# Altium schematic sheet ushio_rp2040.SchDoc: USHIO RP2040
size A3; SheetNumber: 1; SheetTotal: 1
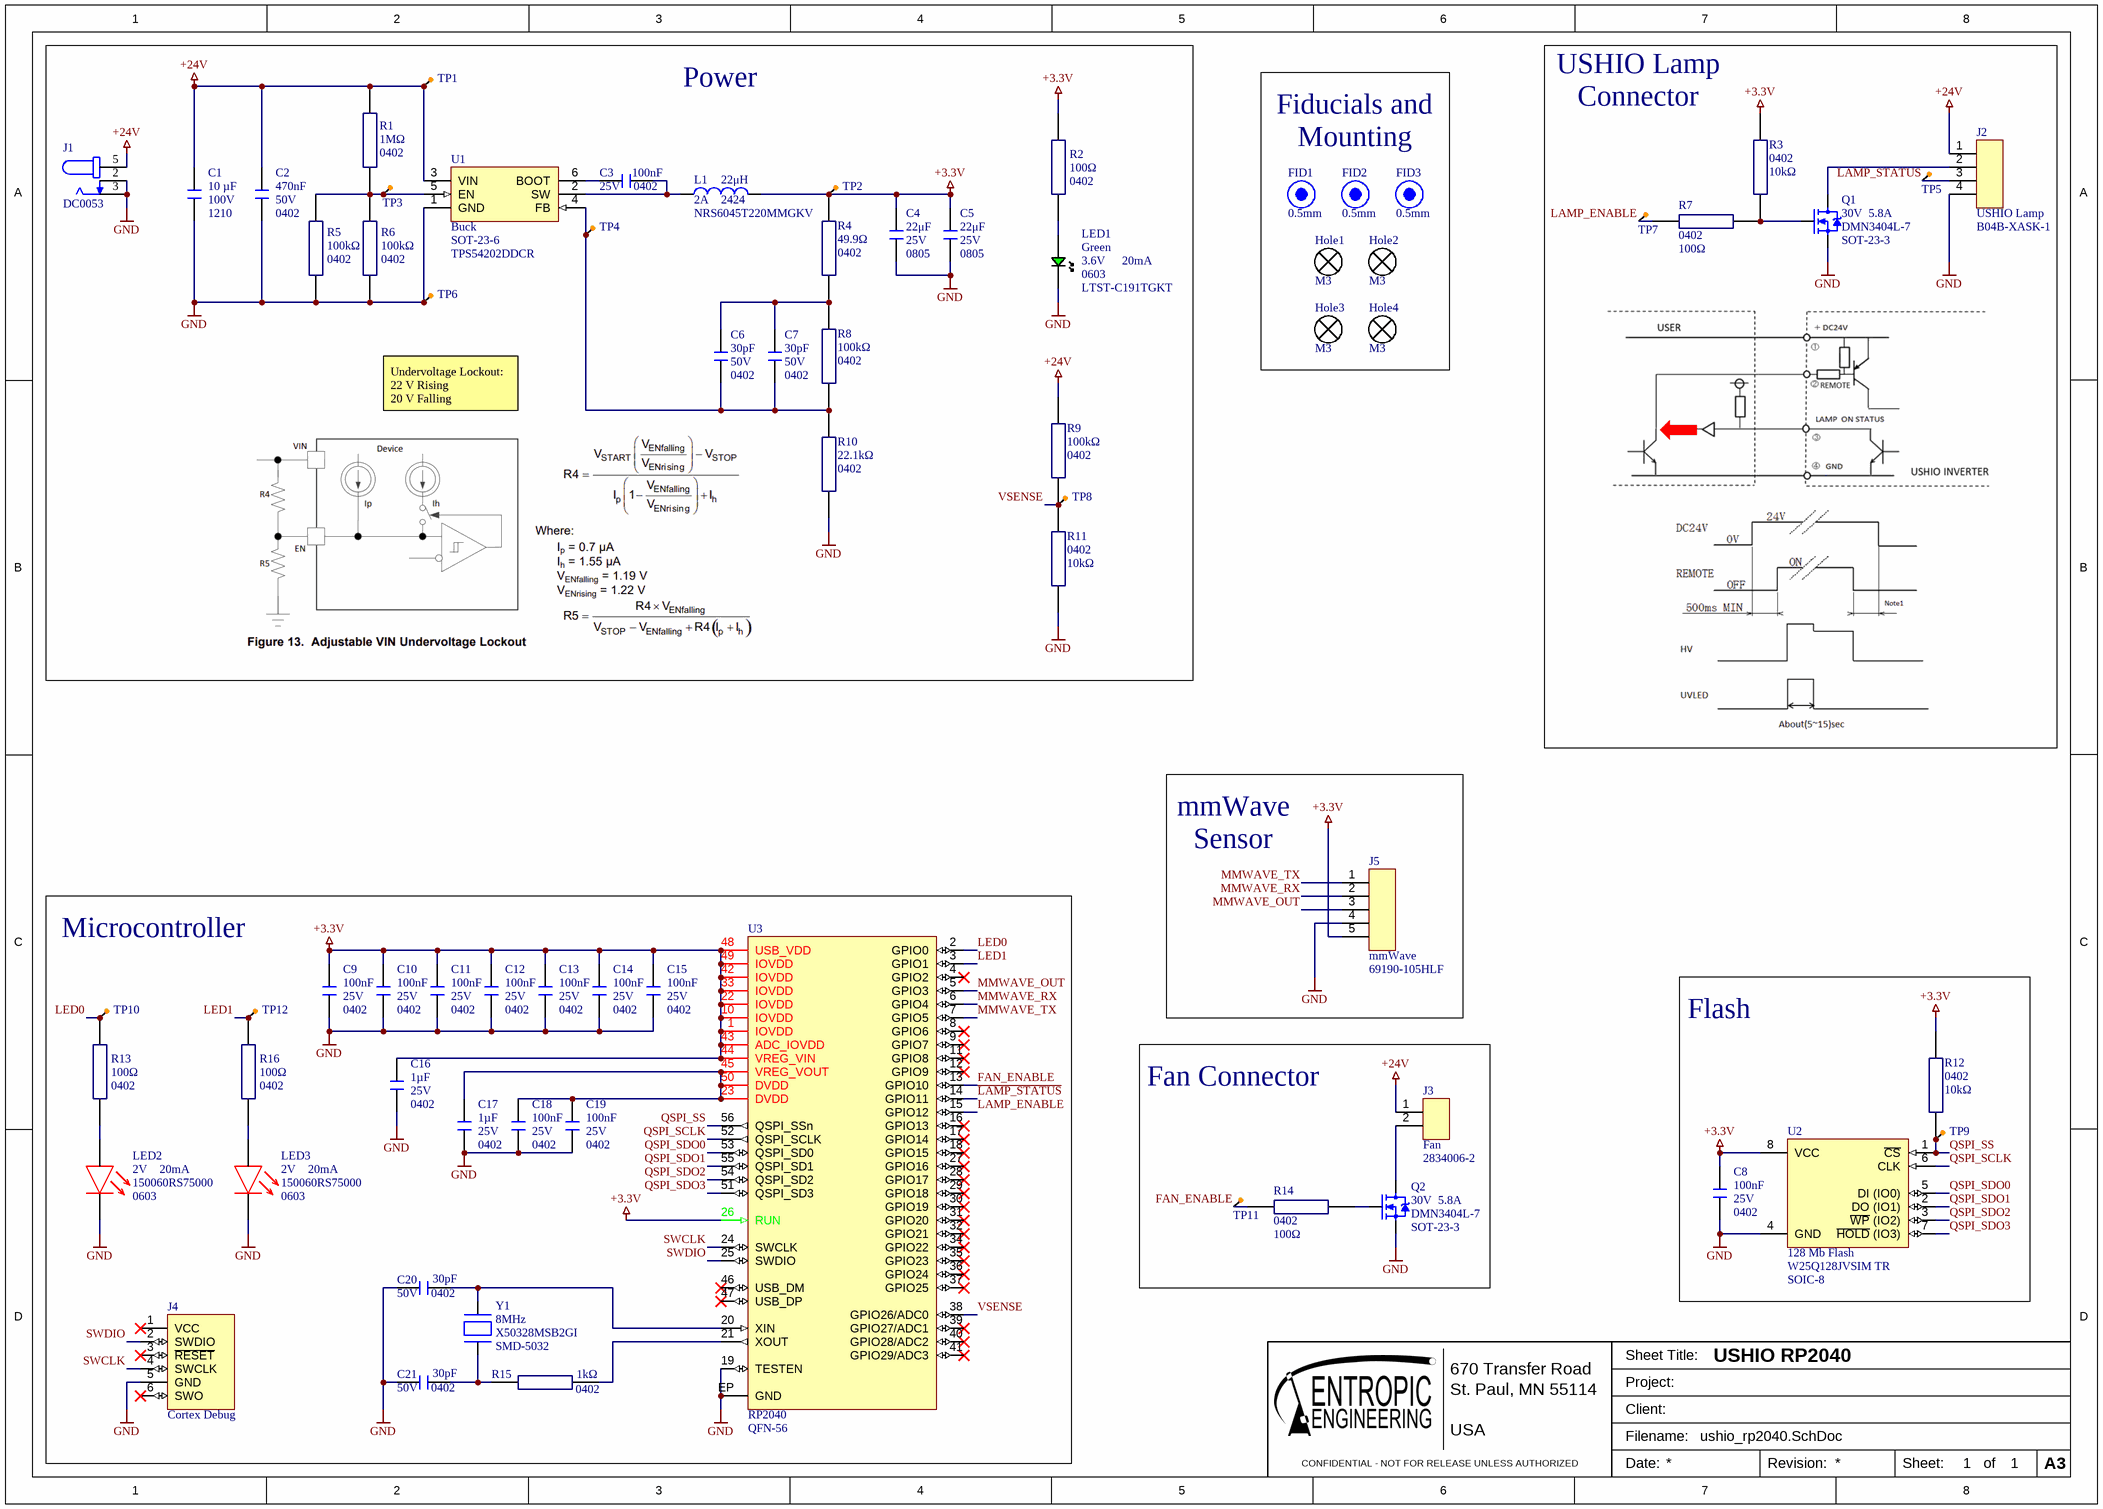
[diagram p0: ushio_rp2040.SchDoc]

## Parts
C1  Voltage Rating: 100V  Case/Package: 1210  Capacitance: 10 µF  [1210_capacitor]  (hidden comment: GRM32EC72A106KE05L)
C2  Package: 0402  Voltage Rating (DC): 50V  Capacitance: 470nF  [0402_capacitor]  (hidden comment: GRM155R61H474KE11D)
C3  Case Code (Imperial): 0402  Voltage: 25V  Capacitance: 100nF  [0402_capacitor]  (hidden comment: GRM155R71E104KE14D)
C4  value 22μF  Rated DC Voltage (URdc): 25V  Case/Package: 0805  [0805_capacitor]  (hidden comment: GRT21BR61E226ME13L)
C5  value 22μF  Rated DC Voltage (URdc): 25V  Case/Package: 0805  [0805_capacitor]  (hidden comment: GRT21BR61E226ME13L)
C6  value 30pF  Rated DC Voltage (URdc): 50V  Case/Package: 0402  [0402_capacitor]  (hidden comment: GCM1555C1H300FA16D)
C7  value 30pF  Rated DC Voltage (URdc): 50V  Case/Package: 0402  [0402_capacitor]  (hidden comment: GCM1555C1H300FA16D)
C8  Case Code (Imperial): 0402  Voltage: 25V  Capacitance: 100nF  [0402_capacitor]  (hidden comment: GRM155R71E104KE14D)
C9  Case Code (Imperial): 0402  Voltage: 25V  Capacitance: 100nF  [0402_capacitor]  (hidden comment: GRM155R71E104KE14D)
C10  Case Code (Imperial): 0402  Voltage: 25V  Capacitance: 100nF  [0402_capacitor]  (hidden comment: GRM155R71E104KE14D)
C11  Case Code (Imperial): 0402  Voltage: 25V  Capacitance: 100nF  [0402_capacitor]  (hidden comment: GRM155R71E104KE14D)
C12  Case Code (Imperial): 0402  Voltage: 25V  Capacitance: 100nF  [0402_capacitor]  (hidden comment: GRM155R71E104KE14D)
C13  Case Code (Imperial): 0402  Voltage: 25V  Capacitance: 100nF  [0402_capacitor]  (hidden comment: GRM155R71E104KE14D)
C14  Case Code (Imperial): 0402  Voltage: 25V  Capacitance: 100nF  [0402_capacitor]  (hidden comment: GRM155R71E104KE14D)
C15  Case Code (Imperial): 0402  Voltage: 25V  Capacitance: 100nF  [0402_capacitor]  (hidden comment: GRM155R71E104KE14D)
C16  Size Code: 0402  Capacitance: 1µF  Voltage: 25V  [0402_capacitor]  (hidden comment: GRM155R61E105KA12D)
C17  Size Code: 0402  Capacitance: 1µF  Voltage: 25V  [0402_capacitor]  (hidden comment: GRM155R61E105KA12D)
C18  Case Code (Imperial): 0402  Voltage: 25V  Capacitance: 100nF  [0402_capacitor]  (hidden comment: GRM155R71E104KE14D)
C19  Case Code (Imperial): 0402  Voltage: 25V  Capacitance: 100nF  [0402_capacitor]  (hidden comment: GRM155R71E104KE14D)
C20  value 30pF  Rated DC Voltage (URdc): 50V  Case/Package: 0402  [0402_capacitor]  (hidden comment: GCM1555C1H300FA16D)
C21  value 30pF  Rated DC Voltage (URdc): 50V  Case/Package: 0402  [0402_capacitor]  (hidden comment: GCM1555C1H300FA16D)
FID1  Package: 0.5mm  [fiducial-0.5]  (hidden comment: FID?)  (no BOM)
FID2  Package: 0.5mm  [fiducial-0.5]  (hidden comment: FID?)  (no BOM)
FID3  Package: 0.5mm  [fiducial-0.5]  (hidden comment: FID?)  (no BOM)
Hole1  M3  [m3_hole_no_pad]  (no BOM)
Hole2  M3  [m3_hole_no_pad]  (no BOM)
Hole3  M3  [m3_hole_no_pad]  (no BOM)
Hole4  M3  [m3_hole_no_pad]  (no BOM)
J1  DC0053  [DC0053]
J2  USHIO Lamp  [B04B-XASK-1]
J3  Fan  [2834006-2]
J4  Cortex Debug  [debug_header]  (no BOM)
J5  mmWave  [69190-105HLF]
L1  Case/Size Code: 2424  Max Current Rating: 2A  Inductance-Nom (L): 22μH  [2424_inductor]  (hidden comment: NRS6045T220MMGKV)
LED1  Forward Current-Max: 20mA  Forward Voltage-Max: 3.6V  Color: Green  Package: 0603  [0603_diode]  (hidden comment: LTST-C191TGKT)
LED2  Forward Current: 20mA  Forward Voltage: 2V  package: 0603  [0603_diode]  (hidden comment: 150060RS75000)
LED3  Forward Current: 20mA  Forward Voltage: 2V  package: 0603  [0603_diode]  (hidden comment: 150060RS75000)
Q1  DS Breakdown Voltage-Min: 30V  Drain Current-Max (ID): 5.8A  [SOT-23-3]  (hidden comment: DMN3404L-7)
Q2  DS Breakdown Voltage-Min: 30V  Drain Current-Max (ID): 5.8A  [SOT-23-3]  (hidden comment: DMN3404L-7)
R1  Size Code: 0402  Resistance: 1MΩ  [0402_resistor]  (hidden comment: RC0402FR-071ML)
R2  Case Code (Imperial): 0402  Resistance: 100Ω  [0402_resistor]  (hidden comment: RMCF0402FT100R)
R3  Case Code (Imperial): 0402  Resistance: 10kΩ  [0402_resistor]  (hidden comment: RMCF0402FT10K0)
R4  Resistance: 49.9Ω  Case Code (Imperial): 0402  [0402_resistor]  (hidden comment: RMCF0402FT49R9)
R5  value 100kΩ  Case/Package: 0402  [0402_resistor]  (hidden comment: RMCF0402FT100K)
R6  value 100kΩ  Case/Package: 0402  [0402_resistor]  (hidden comment: RMCF0402FT100K)
R7  Case Code (Imperial): 0402  Resistance: 100Ω  [0402_resistor]  (hidden comment: RMCF0402FT100R)
R8  value 100kΩ  Case/Package: 0402  [0402_resistor]  (hidden comment: RMCF0402FT100K)
R9  value 100kΩ  Case/Package: 0402  [0402_resistor]  (hidden comment: RMCF0402FT100K)
R10  value 22.1kΩ  Case/Package: 0402  [0402_resistor]  (hidden comment: RMCF0402FT22K1)
R11  Case Code (Imperial): 0402  Resistance: 10kΩ  [0402_resistor]  (hidden comment: RMCF0402FT10K0)
R12  Case Code (Imperial): 0402  Resistance: 10kΩ  [0402_resistor]  (hidden comment: RMCF0402FT10K0)
R13  Case Code (Imperial): 0402  Resistance: 100Ω  [0402_resistor]  (hidden comment: RMCF0402FT100R)
R14  Case Code (Imperial): 0402  Resistance: 100Ω  [0402_resistor]  (hidden comment: RMCF0402FT100R)
R15  Size Code: 0402  Resistance: 1kΩ  [0402_resistor]  (hidden comment: CR0402-FX-1001GLF)
R16  Case Code (Imperial): 0402  Resistance: 100Ω  [0402_resistor]  (hidden comment: RMCF0402FT100R)
TP1  test_point-1  [test_point-1]  (value not drawn)  (no BOM)
TP2  test_point-1  [test_point-1]  (value not drawn)  (no BOM)
TP3  test_point-1  [test_point-1]  (value not drawn)  (no BOM)
TP4  test_point-1  [test_point-1]  (value not drawn)  (no BOM)
TP5  test_point-1  [test_point-1]  (value not drawn)  (no BOM)
TP6  test_point-1  [test_point-1]  (value not drawn)  (no BOM)
TP7  test_point-1  [test_point-1]  (value not drawn)  (no BOM)
TP8  test_point-1  [test_point-1]  (value not drawn)  (no BOM)
TP9  test_point-1  [test_point-1]  (value not drawn)  (no BOM)
TP10  test_point-1  [test_point-1]  (value not drawn)  (no BOM)
TP11  test_point-1  [test_point-1]  (value not drawn)  (no BOM)
TP12  test_point-1  [test_point-1]  (value not drawn)  (no BOM)
U1  Buck  [SOT-23-6]
U2  128 Mb Flash  Case/Package: SOIC-8  [SOIC-8_wide]
U3  RP2040  [QFN-56]
Y1  Frequency: 8MHz  [SMD-5032]  (hidden comment: X50328MSB2GI)

## Nets
+3.3V: C4.2 C5.2 C8.2 C9.2 C10.2 C11.2 C12.2 C13.2 C14.2 C15.2 C16.2 J5.5 L1.2 R2.2 R3.1 R4.2 R12.2 TP2.1 U2.8(VCC) U3.1(IOVDD) U3.10(IOVDD) U3.22(IOVDD) U3.26(RUN) U3.33(IOVDD) U3.42(IOVDD) U3.43(ADC_IOVDD) U3.44(VREG_VIN) U3.48(USB_VDD) U3.49(IOVDD)
+24V: C1.2 C2.2 J1.5(TIP) J2.1 J3.1 R1.2 R9.2 TP1.1 U1.3(VIN)
GND: C1.1 C2.1 C4.1 C5.1 C8.1 C9.1 C10.1 C11.1 C12.1 C13.1 C14.1 C15.1 C16.1 C17.1 C18.1 C19.1 C20.1 C21.1 J1.2(SWITCH) J1.3(SLEEVE) J2.4 J4.5(GND) J5.4 LED1.2(K) LED2.2 LED3.2 Q1.2(S) Q2.2(S) R5.1 R6.1 R10.1 R11.1 TP6.1 U1.1(GND) U2.4(GND) U3.19(TESTEN) U3.EP(GND)
~{LAMP_STATUS}: J2.3 TP5.1 U3.14(GPIO11)
FAN_ENABLE: R14.1 TP11.1 U3.13(GPIO10)
LAMP_ENABLE: R7.1 TP7.1 U3.15(GPIO12)
LED0: R13.2 TP10.1 U3.2(GPIO0)
LED1: R16.2 TP12.1 U3.3(GPIO1)
MMWAVE_OUT: J5.3 U3.5(GPIO3)
MMWAVE_RX: J5.2 U3.6(GPIO4)
MMWAVE_TX: J5.1 U3.7(GPIO5)
QSPI_SCLK: U2.6(CLK) U3.52(QSPI_SCLK)
QSPI_SDO0: U2.5(DI_(IO0)) U3.53(QSPI_SD0)
QSPI_SDO1: U2.2(DO_(IO1)) U3.55(QSPI_SD1)
QSPI_SDO2: U2.3(~{WP}_(IO2)) U3.54(QSPI_SD2)
QSPI_SDO3: U2.7(~{HOLD}_(IO3)) U3.51(QSPI_SD3)
QSPI_SS: R12.1 TP9.1 U2.1(~{CS}) U3.56(QSPI_SSn)
SWCLK: J4.4(SWCLK) U3.24(SWCLK)
SWDIO: J4.2(SWDIO) U3.25(SWDIO)
VSENSE: R9.1 R11.2 TP8.1 U3.38(GPIO26/ADC0)
NetC3_1: C3.1 L1.1 U1.2(SW)
NetC3_2: C3.2 U1.6(BOOT)
NetC6_1: C6.1 C7.1 R8.1 R10.2 TP4.1 U1.4(FB)
NetC6_2: C6.2 C7.2 R4.1 R8.2
NetC17_2: C17.2 C18.2 C19.2 U3.23(DVDD) U3.45(VREG_VOUT) U3.50(DVDD)
NetC20_2: C20.2 U3.20(XIN) Y1.2
NetC21_2: C21.2 R15.1 Y1.1
NetJ2_2: J2.2 Q1.3(D)
NetJ3_2: J3.2 Q2.3(D)
NetLED1_1: LED1.1(A) R2.1
NetLED2_1: LED2.1 R13.1
NetLED3_1: LED3.1 R16.1
NetQ1_1: Q1.1(G) R3.2 R7.2
NetQ2_1: Q2.1(G) R14.2
NetR1_1: R1.1 R5.2 R6.2 TP3.1 U1.5(EN)
NetR15_2: R15.2 U3.21(XOUT)

Not connected (* = marked no-connect by the designer): J4 1(VCC)* 3(~{RESET})* 6(SWO)*; U3 4(GPIO2)* 8(GPIO6)* 9(GPIO7)* 11(GPIO8)* 12(GPIO9)* 16(GPIO13)* 17(GPIO14)* 18(GPIO15)* 27(GPIO16)* 28(GPIO17)* 29(GPIO18)* 30(GPIO19)* 31(GPIO20)* 32(GPIO21)* 34(GPIO22)* 35(GPIO23)* 36(GPIO24)* 37(GPIO25)* 39(GPIO27/ADC1)* 40(GPIO28/ADC2)* 41(GPIO29/ADC3)* 46(USB_DM)* 47(USB_DP)*

## Notes on the sheet
- Power
- Fiducials and Mounting
- (near R3) USHIO Lamp Connector
- Undervoltage Lockout:
  22 V Rising
  20 V Falling
- mmWave Sensor
- Microcontroller
- Flash
- Fan Connector
- 670 Transfer Road
- St. Paul, MN 55114
- Sheet Title:
- Project:
- CONFIDENTIAL - NOT FOR RELEASE UNLESS AUTHORIZED
- USA
- Client:
- Filename:
- Date:
- Revision:
- Sheet:
- of
- A3

## Library data of the parts
C1 = GRM32EC72A106KE05L: 10 µF, 100 V, 1210 Ceramic capacitor; Manufacturer: Murata; Tolerance: 10%; Supplier 1: Digi-Key; Stock 1: 4827; Pricing 1: 1=1.38, 10=1.087, 100=0.8151, 500=0.61582 (USD); Mount: Surface Mount; Case Code (Imperial): 1210; Case Code (Metric): 3225; Min Operating Temperature: -55°C; Max Operating Temperature: 125°C; Packaging: Tape and Reel; ComponentLink1URL: http://search.murata.co.jp/Ceramy/image/img/A01X/G101/ENG/GRM32EC72A106KE05-01.pdf?src-supplier=Digi-Key; ComponentLink1Description: http://search.murata.co.jp/Ceramy/image/img/A01X/G101/ENG/GRM32EC72A106KE05-01.pdf?src-supplier=Digi-Key; Supplier Part Number 1: 490-16266-1-ND; Manufacturer Part Number: GRM32EC72A106KE05L
C2 = GRM155R61H474KE11D: 470 nF, 50 V, X5R, 0402 Chip capacitor; Manufacturer: Murata; house_part_number: C-470nF-0402-002; Tolerance: 10%; Supplier 1: Digi-Key; Supplier Part Number 1: 490-16354-1-ND; RoHS: Yes; Category: Ceramic Capacitors; Pricing 1: 1=0.20000, 10=0.14600, 50=0.08260, 100=0.06840, 500=0.04798, 1000=0.03972, 2500=0.03696, 5000=0.03382 (USD); Dielectric: X5R; Length: 1mm; Width: 500um; Thickness: 500um; RoHS Compliant: Yes; ComponentLink1URL: http://search.murata.co.jp/Ceramy/image/img/A01X/G101/ENG/GRM155R61H474KE11-01.pdf?src-supplier=Digi-Key; ComponentLink1Description: http://search.murata.co.jp/Ceramy/image/img/A01X/G101/ENG/GRM155R61H474KE11-01.pdf?src-supplier=Digi-Key; ComponentLink2URL: https://search.murata.co.jp/Ceramy/image/img/A01X/G101/ENG/GRM155R61H474KE11-01.pdf?src-supplier=Digi-Key; ComponentLink2Description: https://search.murata.co.jp/Ceramy/image/img/A01X/G101/ENG/GRM155R61H474KE11-01.pdf?src-supplier=Digi-Key; Manufacturer Part Number: GRM155R61H474KE11D
C3 C8-C15 C18 C19 = GRM155R71E104KE14D: 100 nF, 25 V, X7R, 0402 Chip capacitor; Manufacturer: Murata; house_part_number: C-100nF-0402-002; Dielectric Material: Ceramic; Tolerance: 10%; Supplier 1: Digi-Key; Supplier Part Number 1: 490-10698-1-ND; RoHS: Yes; Category: Ceramic Capacitors; Pricing 1: 1=0.10000, 10=0.02700, 50=0.01460, 100=0.01190, 500=0.00848, 1000=0.00666, 2500=0.00605, 5000=0.00557 (USD); Mount: Surface Mount; Case/Package: 0402; Case Code (Metric): 1005; Weight: 0.000212oz; Min Operating Temperature: -55°C; Max Operating Temperature: 125°C; Packaging: Tape and Reel; Voltage Rating: 25V; Dielectric: X7R; Termination: SMD/SMT; Resistor Type: Ceramic; Voltage Rating (DC): 25V; Package Quantity: 10000; Length: 1mm; Width: 0.02inch; Height: 0.5mm; Thickness: 0.022inch; Depth: 0.5mm; REACH SVHC: Unknown; Lead Free: Lead Free; RoHS Compliant: Yes; ComponentLink1URL: http://www.farnell.com/datasheets/1872206.pdf?src-supplier=Farnell; ComponentLink1Description: http://www.farnell.com/datasheets/1872206.pdf?src-supplier=Farnell; ComponentLink2URL: http://components.arrow.com/part/dataview/0323_06361249?src-supplier=Arrow+Europe; ComponentLink2Description: http://components.arrow.com/part/dataview/0323_06361249?src-supplier=Arrow+Europe; ComponentLink3URL: http://uk.rs-online.com/webdocs/144c/0900766b8144c113.pdf?src-supplier=RSComponents; ComponentLink3Description: http://uk.rs-online.com/webdocs/144c/0900766b8144c113.pdf?src-supplier=RSComponents; ComponentLink4URL: http://www.farnell.com/datasheets/2048008.pdf?src-supplier=Farnell; ComponentLink4Description: http://www.farnell.com/datasheets/2048008.pdf?src-supplier=Farnell; ComponentLink5URL: http://www.mouser.com/ds/2/281/c02e-2905.pdf?src-supplier=Mouser; ComponentLink5Description: http://www.mouser.com/ds/2/281/c02e-2905.pdf?src-supplier=Mouser; ComponentLink6URL: http://www.farnell.com/datasheets/2048008.pdf?src-supplier=Newark; ComponentLink6Description: http://www.farnell.com/datasheets/2048008.pdf?src-supplier=Newark; ComponentLink7URL: https://search.murata.co.jp/Ceramy/image/img/A01X/G101/ENG/GRM155R71E104KE14-01.pdf?src-supplier=Digi-Key; ComponentLink7Description: https://search.murata.co.jp/Ceramy/image/img/A01X/G101/ENG/GRM155R71E104KE14-01.pdf?src-supplier=Digi-Key; ComponentLink8URL: http://www.farnell.com/datasheets/2048008.pdf?src-supplier=Element14; ComponentLink8Description: http://www.farnell.com/datasheets/2048008.pdf?src-supplier=Element14; ComponentLink9URL: http://psearch.en.murata.com/capacitor/product/GRM155R71E104KE14%23.pdf?src-supplier=Avnet; ComponentLink9Description: http://psearch.en.murata.com/capacitor/product/GRM155R71E104KE14%23.pdf?src-supplier=Avnet; Manufacturer Part Number: GRM155R71E104KE14D
C4 C5 = GRT21BR61E226ME13L: 22 μF, 25 V, X5R, 0805 Chip capacitor; Manufacturer: Murata; Dielectric Material: Ceramic; Multilayer: Yes; Tolerance  (fill in as +-): 20%; Reference Standard: AEC-Q200; Supplier 1: Digi-Key; RoHS: Yes; Category: Ceramic Capacitors; Stock 1: 1983731; Pricing 1: 1=0.48, 10=0.338, 50=0.2558, 100=0.2228, 500=0.16508, 1000=0.14031 (USD); Mounting Technology: Surface Mount; Pins: 2; Package Shape: Rectangular; Terminal Finish: Nickel; Min Operating Temperature: -55°C; Max Operating Temperature: 85°C; JESD-609 Code: e3; Capacitor Type: Ceramic; Packaging: Tape and Reel; Tolerance (fill in as +-): 20%; Temperature Characteristics Code: X5R; Termination: Wraparound; Reach SVHC Compliant: Yes; RoHS Compliant: Yes; ComponentLink1URL: https://datasheet.ciiva.com:443/pdfs/VipMasterIC/IC/MURE/MURE-S-A0004410517/MURE-S-A0004413512-1.pdf?src-supplier=IHS+Markit; ComponentLink1Description: https://datasheet.ciiva.com:443/pdfs/VipMasterIC/IC/MURE/MURE-S-A0004410517/MURE-S-A0004413512-1.pdf?src-supplier=IHS+Markit; ComponentLink2URL: http://search.murata.co.jp/Ceramy/image/img/A01X/G101/ENG/GRT21BR61E226ME13-01.pdf?src-supplier=Digi-Key; ComponentLink2Description: http://search.murata.co.jp/Ceramy/image/img/A01X/G101/ENG/GRT21BR61E226ME13-01.pdf?src-supplier=Digi-Key; Manufacturer Part Number: GRT21BR61E226ME13L; Supplier Part Number 1: 490-12389-1-ND
C6 C7 C20 C21 = GCM1555C1H300FA16D: 30 pF, 50 V, C0G, 0402 Chip capacitor; Manufacturer: Murata; Dielectric Material: Ceramic; Multilayer: Yes; Tolerance  (fill in as +-): 1%; Reference Standard: AEC-Q200; Supplier 1: LCSC; Manufacturer Part Number: GCM1555C1H300FA16D; RoHS: Yes; Category: Ceramic Capacitors; Stock 1: 20680; Pricing 1: 20=0.0242, 200=0.0198, 600=0.0174, 2000=0.0159, 10000=0.0143, 20000=0.0137 (USD); Mounting Technology: Surface Mount; Pins: 2; Package Shape: Rectangular; Min Operating Temperature: -55°C; Max Operating Temperature: 125°C; Capacitor Type: Ceramic; Packaging: Tape and Reel; Tolerance (fill in as +-): 1%; Temperature Characteristics Code: C0G; Termination: Wraparound; Reach SVHC Compliant: Yes; RoHS Compliant: Yes; ComponentLink1URL: https://psearch.en.murata.com:443/capacitor/product/GCM1555C1H300FA16%23.pdf?src-supplier=IHS+Markit; ComponentLink1Description: https://psearch.en.murata.com:443/capacitor/product/GCM1555C1H300FA16%23.pdf?src-supplier=IHS+Markit; Supplier Part Number 1: C2987943
C16 C17 = GRM155R61E105KA12D: 1 µF, 25 V, X5R, 0402 Chip capacitor; Manufacturer: Murata; house_part_number: C-1uF-0402-002; Dielectric Material: Ceramic; Multilayer: Yes; Negative Tolerance: 10%; Supplier 1: Digi-Key; Supplier Part Number 1: 490-10017-1-ND; RoHS: Yes; Category: Ceramic Capacitors; Stock 1: 145965; Pricing 1: 1=0.11000, 10=0.08300, 50=0.04560, 100=0.03720, 500=0.02656, 1000=0.02087, 2500=0.01898, 5000=0.01746 (USD); Mount: Surface Mount; Number of Pins: 2; Package Shape: Rectangular; Terminal Finish: Nickel; Min Operating Temperature: -55°C; Max Operating Temperature: 85°C; JESD-609 Code: e3; Capacitor Type: Ceramic; Package Style: SMTMeter; Packaging: Tape and Reel; Positive Tolerance: 10%; Temperature Characteristics Code: X5R; Termination: Wraparound; Length: 1mm; Width: 0.5mm; Height: 0.5mm; REACH SVHC: Yes; RoHS Compliant: Yes; ComponentLink1URL: https://datasheet.ciiva.com:443/pdfs/VipMasterIC/IC/MURE/MURE-S-A0004362469/MURE-S-A0004364524-1.pdf?src-supplier=IHS+Markit; ComponentLink1Description: https://datasheet.ciiva.com:443/pdfs/VipMasterIC/IC/MURE/MURE-S-A0004362469/MURE-S-A0004364524-1.pdf?src-supplier=IHS+Markit; ComponentLink2URL: https://datasheet.ciiva.com/7719/1666664-7719006.pdf?src-supplier=Element14; ComponentLink2Description: https://datasheet.ciiva.com/7719/1666664-7719006.pdf?src-supplier=Element14; ComponentLink3URL: https://datasheet.ciiva.com/22732/1666664-22732122.pdf?src-supplier=Element14; ComponentLink3Description: https://datasheet.ciiva.com/22732/1666664-22732122.pdf?src-supplier=Element14; Manufacturer Part Number: GRM155R61E105KA12D
FID1-FID3 = fiducial-0.5: 0.5mm round fiducial
Hole1-Hole4 = m3_hole_no_pad: M3 clearance hole; pickable: no
J1 = DC0053: 5.5 mm x 2 mm Barrel jack; Manufacturer: SHOU HAN; Supplier 1: LCSC; RoHS: No; Category: Uncategorized; Stock 1: 2415; Pricing 1: 5=0.0927, 50=0.0762, 150=0.0679, 500=0.0565, 2500=0.0515, 5000=0.0491 (USD); Supplier Part Number 1: C668601; Manufacturer Part Number: DC0053
J2 = B04B-XASK-1: 4-pin JST XA header, 2.5mm pitch, through-hole; Supplier 1: Digi-Key; Manufacturer: JST; RoHS: No; Category: Connectors; Stock 1: 159148; Pricing 1: 1=0.32, 10=0.269, 100=0.2093, 500=0.17938, 1000=0.14948, 5000=0.12812, 10000=0.11958 (USD); ComponentLink1URL: https://datasheet.ciiva.com/719/exa1-719638.pdf?src-supplier=Digi-Key; ComponentLink1Description: https://datasheet.ciiva.com/719/exa1-719638.pdf?src-supplier=Digi-Key; Supplier Part Number 1: 455-B04B-XASK-1-ND; Manufacturer Part Number: B04B-XASK-1
J3 = 2834006-2: 2-Pin Barrier Strip Terminal Block; Manufacturer: TE Connectivity; Supplier 1: LCSC; RoHS: Yes; Category: Connectors; Stock 1: 6498; Pricing 1: 1=0.4073, 10=0.3326, 30=0.3007, 100=0.261, 500=0.2212, 800=0.21 (USD); Terminal and Terminal Block Type: BARRIER STRIP TERMINAL BLOCK; Reach SVHC Compliant: Yes; RoHS Compliant: Yes; ComponentLink1URL: https://datasheet.ciiva.com:443/pdfs/VipMasterIC/IC/TYEL/TYEL-S-A0008901127/TYEL-S-A0008894062-1.pdf?src-supplier=IHS+Markit; ComponentLink1Description: https://datasheet.ciiva.com:443/pdfs/VipMasterIC/IC/TYEL/TYEL-S-A0008901127/TYEL-S-A0008894062-1.pdf?src-supplier=IHS+Markit; ComponentLink2URL: http://www.mouser.com/ds/2/418/NG_CD_2834006_A-773085.pdf?src-supplier=Mouser; ComponentLink2Description: http://www.mouser.com/ds/2/418/NG_CD_2834006_A-773085.pdf?src-supplier=Mouser; ComponentLink3URL: http://www.farnell.com/datasheets/2299783.pdf?src-supplier=Farnell; ComponentLink3Description: http://www.farnell.com/datasheets/2299783.pdf?src-supplier=Farnell; ComponentLink4URL: http://www.farnell.com/datasheets/2299783.pdf?src-supplier=Element14; ComponentLink4Description: http://www.farnell.com/datasheets/2299783.pdf?src-supplier=Element14; ComponentLink5URL: http://www.farnell.com/datasheets/2017940.pdf?src-supplier=Element14; ComponentLink5Description: http://www.farnell.com/datasheets/2017940.pdf?src-supplier=Element14; ComponentLink6URL: https://www.te.com/commerce/DocumentDelivery/DDEController?Action=srchrtrv&amp;DocNm=2834006&amp;DocType=Customer+Drawing&amp;DocLang=English&src-supplier=Digi-Key; ComponentLink6Description: https://www.te.com/commerce/DocumentDelivery/DDEController?Action=srchrtrv&amp;DocNm=2834006&amp;DocType=Customer+Drawing&amp;DocLang=English&src-supplier=Digi-Key; Supplier Part Number 1: C86483; Manufacturer Part Number: 2834006-2
J4 = debug_header: Tag-connect 6-pin pogo header; pickable: no
J5 = 69190-105HLF: 5-pin 0.1" unshrouded header pins; Manufacturer: Amphenol ICC / FCI; Manufacturer Series: 69190; Connector Type: BOARD CONNECTOR; Option: General Purpose; Contact Pattern: RECTANGULAR; Contact Style: SQ PIN-SKT; Filter Feature: No; Number Of Connectors: 1; Number of Contacts: 5; Body Breadth: 0.095inch; Body Depth: 0.1inch; Body Length: 0.5inch; Mounting Option 1: LOCKING; Plating Thickness: 30uin; Reference Standard: UL; Reliability: COMMERCIAL; Supplier 1: Digi-Key; RoHS: Yes; Category: Connectors; Stock 1: 3670; Pricing 1: 1=0.47, 10=0.402, 100=0.3123, 500=0.26768, 1000=0.22306, 5000=0.19119, 10000=0.17845 (USD); Mounting Technology: Board; Contact Material: Bronze; Contact Finish - Termination: GOLD (30) OVER NICKEL/NICKEL PALLADIUM GOLD (30) OVER NICKEL; Insulation Color: Black; JESD-609 Code: e4; Contact Gender: Male; Mixed Contacts: No; Mounting Style: STRAIGHT; Number Of PCB Rows: 1; Number of Rows Loaded: 1; PCB Contact Pattern: RECTANGULAR; Termination: Solder; Mating Contact Pitch: 0.1inch; Terminal Length: 0.12inch; Terminal Pitch: 2.54mm; Flammability Rating: UL94 V-0; DIN Conformance: No; IEC Conformance: No; MIL Conformance: No; Reach SVHC Compliant: Yes; RoHS Compliant: Yes; ComponentLink1URL: https://datasheet.ciiva.com/721/69190-721296.pdf?src-supplier=Digi-Key; ComponentLink1Description: https://datasheet.ciiva.com/721/69190-721296.pdf?src-supplier=Digi-Key; Supplier Part Number 1: 609-69190-105HLF-ND; Manufacturer Part Number: 69190-105HLF
L1 = NRS6045T220MMGKV: 22 μH, 2 A, 20%, 2424 Inductor; Manufacturer: Taiyo Yuden; DC Resistance (DCR): 139.1mΩ; Inductor Application: RF INDUCTOR; Inductor Type: GENERAL PURPOSE INDUCTOR; Channels: 1; Self Resonant Frequency: 7MHz; Shape/Size Description: RECTANGULAR PACKAGE; Shielding: Unshielded; Test Frequency: 100kHz; Reference Standard: AEC-Q200; Supplier 1: LCSC; RoHS: Yes; Category: Fixed Inductors; Stock 1: 877; Pricing 1: 1=0.2713, 10=0.2238, 30=0.2035, 100=0.1781, 500=0.1668, 1500=0.16 (USD); Pins: 2; Min Operating Temperature: -40°C; Max Operating Temperature: 125°C; Tolerance: 20%; Surface Mount: Yes; Terminal Placement: Dual Ended; Termination: One Surface; Reach SVHC Compliant: Yes; RoHS Compliant: Yes; ComponentLink1URL: https://datasheet.ciiva.com:443/pdfs/VipMasterIC/IC/TAIY/TAIY-S-A0009101225/TAIY-S-A0009101504-1.pdf?src-supplier=IHS+Markit; ComponentLink1Description: https://datasheet.ciiva.com:443/pdfs/VipMasterIC/IC/TAIY/TAIY-S-A0009101225/TAIY-S-A0009101504-1.pdf?src-supplier=IHS+Markit; ComponentLink2URL: https://datasheet.ciiva.com/29697/nrs6045t220mmgkv-ss-29697444.pdf?src-supplier=Digi-Key; ComponentLink2Description: https://datasheet.ciiva.com/29697/nrs6045t220mmgkv-ss-29697444.pdf?src-supplier=Digi-Key; Supplier Part Number 1: C515390; Manufacturer Part Number: NRS6045T220MMGKV
LED1 = LTST-C191TGKT: Green LED, 0603; Manufacturer: Vishay Lite-On; Shape: Rectangular; Lens Style: WATER CLEAR; Luminous Intensity-Min: 130cd; Luminous Intensity-Nom: 260.5mcd; Number of Functions: 1; Optoelectronic Device Type: SINGLE COLOR LED; Reverse Voltage-Max: 5V; Viewing Angle: 130°; Overall Height: 0.55mm; Supplier 1: Digi-Key; RoHS: Yes; Category: LEDs; Stock 1: 478546; Pricing 1: 1=0.53000, 10=0.32300, 100=0.18580, 1000=0.14544, 2000=0.13332 (USD); Mount: Surface Mount; Number of Pins: 2; Color@wavelength: Green; Terminal Finish: Tin; Min Operating Temperature: -20°C; Max Operating Temperature: 80°C; JESD-609 Code: e3; Packaging: Tape and Reel; Size: 1.1mm; Terminal Pitch: 1.5mm; Reach SVHC Compliant: Yes; RoHS Compliant: Yes; ComponentLink1URL: https://datasheet.ciiva.com:443/pdfs/VipMasterIC/IC/LITE/LITE-S-A0003155974/LITE-S-A0003155974-1.pdf?src-supplier=IHS+Markit; ComponentLink1Description: https://datasheet.ciiva.com:443/pdfs/VipMasterIC/IC/LITE/LITE-S-A0003155974/LITE-S-A0003155974-1.pdf?src-supplier=IHS+Markit; ComponentLink2URL: https://datasheet.ciiva.com/16444/ltst-c191tgkt-16444757.pdf?src-supplier=Future+Electronics; ComponentLink2Description: https://datasheet.ciiva.com/16444/ltst-c191tgkt-16444757.pdf?src-supplier=Future+Electronics; ComponentLink3URL: https://datasheet.ciiva.com/11773/0900766b80dc02b5-11773683.pdf?src-supplier=RSComponents; ComponentLink3Description: https://datasheet.ciiva.com/11773/0900766b80dc02b5-11773683.pdf?src-supplier=RSComponents; ComponentLink4URL: https://datasheet.ciiva.com/12403/lite-on-ltst-c191tgkt-190137-12403796.pdf?src-supplier=Mouser; ComponentLink4Description: https://datasheet.ciiva.com/12403/lite-on-ltst-c191tgkt-190137-12403796.pdf?src-supplier=Mouser; ComponentLink5URL: https://datasheet.ciiva.com/6352/s-110-ltst-c191tgkt-6352682.pdf?src-supplier=Digi-Key; ComponentLink5Description: https://datasheet.ciiva.com/6352/s-110-ltst-c191tgkt-6352682.pdf?src-supplier=Digi-Key; ComponentLink6URL: https://datasheet.ciiva.com/6352/s-110-ltst-c191tgkt-6352684.pdf?src-supplier=Digi-Key; ComponentLink6Description: https://datasheet.ciiva.com/6352/s-110-ltst-c191tgkt-6352684.pdf?src-supplier=Digi-Key; ComponentLink7URL: https://datasheet.ciiva.com/6352/s-110-ltst-c191tgkt-6352683.pdf?src-supplier=Digi-Key; ComponentLink7Description: https://datasheet.ciiva.com/6352/s-110-ltst-c191tgkt-6352683.pdf?src-supplier=Digi-Key; Supplier Part Number 1: 160-1888-1-ND; House Part Number: LTST-C191TGKT; Manufacturer Part Number: LTST-C191TGKT
LED2 LED3 = 150060RS75000: Red 0603 LED; Manufacturer: Wurth Electronics; house_part_number: LED-red-0603-002; Shape: Rectangular; Lens Style: WATER CLEAR; Luminous Intensity-Nom: 250mcd; Number of Functions: 1; Optoelectronic Device Type: SINGLE COLOR LED; Viewing Angle: 140°; Overall Height: 0.7mm; Supplier 1: Digi-Key; Supplier Part Number 1: 732-4978-1-ND; RoHS: Yes; Category: LEDs; Stock 1: 210449; Pricing 1: 1=0.14000, 50=0.13300, 100=0.12000, 500=0.11400, 1000=0.09900 (USD); Mount: Surface Mount; Number of Pins: 2; Color: Red; Min Operating Temperature: -40°C; Max Operating Temperature: 85°C; Packaging: Tape and Reel; Size: 1.1mm; Terminal Pitch: 1.6mm; REACH SVHC: Yes; RoHS Compliant: Yes; ComponentLink1URL: https://datasheet.ciiva.com:443/pdfs/VipMasterIC/IC/MIDC/MIDC-S-A0007768849/MIDC-S-A0007768849-1.pdf?src-supplier=IHS+Markit; ComponentLink1Description: https://datasheet.ciiva.com:443/pdfs/VipMasterIC/IC/MIDC/MIDC-S-A0007768849/MIDC-S-A0007768849-1.pdf?src-supplier=IHS+Markit; ComponentLink2URL: https://datasheet.ciiva.com/29563/150060rs75000-29563040.pdf?src-supplier=Digi-Key; ComponentLink2Description: https://datasheet.ciiva.com/29563/150060rs75000-29563040.pdf?src-supplier=Digi-Key; ComponentLink3URL: https://datasheet.ciiva.com/29279/759428-da-01-en-chipled-0603-w-kl-rot-150060rs75000-29279196.pdf?src-supplier=Conrad; ComponentLink3Description: https://datasheet.ciiva.com/29279/759428-da-01-en-chipled-0603-w-kl-rot-150060rs75000-29279196.pdf?src-supplier=Conrad; Manufacturer Part Number: 150060RS75000
Q1 Q2 = DMN3404L-7: N-FET, 30 V, 5.8 A, SOT-23-3; Manufacturer: Diodes; Package Body Material: Plastic; Transistor Element Material: SILICON; Polarity/Channel Type: N-CHANNEL; Additional Feature: HIGH RELIABILITY; Drain-source On Resistance-Max: 28mR; FET Technology: METAL-OXIDE SEMICONDUCTOR; Number of Elements: 1; Operating Mode: ENHANCEMENT MODE; Power Dissipation-Max (Abs): 1.4W; Pulsed Drain Current-Max (IDM): 30A; Time @ Peak Reflow Temperature-Max (s): 40s; Transistor Application: SWITCHING; Qualification Status: Not Qualified; Supplier 1: Digi-Key; RoHS: Yes; Category: MOSFETs; Stock 1: 150000; Pricing 1: 3000=0.07535, 6000=0.06781, 15000=0.06028, 30000=0.05651, 75000=0.05011, 150000=0.04822 (USD); Pins: 3; Package Shape: Rectangular; Terminal Finish: Tin; Max Operating Temperature: 150°C; JESD-609 Code: e3; Drain Current-Max (Abs) (ID): 5.8A; JESD-30 Code: R-PDSO-G3; Moisture Sensitivity Level: 1; Package Style: SMALL OUTLINEMeter; Peak Reflow Temperature (Cel): 260°C; Surface Mount: Yes; Terminal Form: Gull Wing; Terminal Position: DUAL; Reach SVHC Compliant: Yes; RoHS Compliant: Yes; ComponentLink1URL: https://datasheet.ciiva.com:443/pdfs/VipMasterIC/IC/DIOD/DIODS20277/DIODS20277-1.pdf?src-supplier=IHS+Markit; ComponentLink1Description: https://datasheet.ciiva.com:443/pdfs/VipMasterIC/IC/DIOD/DIODS20277/DIODS20277-1.pdf?src-supplier=IHS+Markit; ComponentLink2URL: https://datasheet.ciiva.com/4444/ds31787-65102-4444489.pdf?src-supplier=Mouser; ComponentLink2Description: https://datasheet.ciiva.com/4444/ds31787-65102-4444489.pdf?src-supplier=Mouser; ComponentLink3URL: https://datasheet.ciiva.com/8115/ds31787-8115384.pdf?src-supplier=Avnet; ComponentLink3Description: https://datasheet.ciiva.com/8115/ds31787-8115384.pdf?src-supplier=Avnet; ComponentLink4URL: https://datasheet.ciiva.com/16508/ds31787-16508477.pdf?src-supplier=Future+Electronics; ComponentLink4Description: https://datasheet.ciiva.com/16508/ds31787-16508477.pdf?src-supplier=Future+Electronics; ComponentLink5URL: https://datasheet.ciiva.com/8023/ds31787-8023981.pdf?src-supplier=Element14; ComponentLink5Description: https://datasheet.ciiva.com/8023/ds31787-8023981.pdf?src-supplier=Element14; ComponentLink6URL: https://datasheet.ciiva.com/934/ds31787-934594.pdf?src-supplier=Digi-Key; ComponentLink6Description: https://datasheet.ciiva.com/934/ds31787-934594.pdf?src-supplier=Digi-Key; ComponentLink7URL: https://datasheet.ciiva.com/934/ds31787-934595.pdf?src-supplier=Digi-Key; ComponentLink7Description: https://datasheet.ciiva.com/934/ds31787-934595.pdf?src-supplier=Digi-Key; ComponentLink8URL: https://datasheet.ciiva.com/934/ds31787-934593.pdf?src-supplier=Digi-Key; ComponentLink8Description: https://datasheet.ciiva.com/934/ds31787-934593.pdf?src-supplier=Digi-Key; Supplier Part Number 1: DMN3404LDITR-ND; Package: SOT-23-3; Manufacturer Part Number: DMN3404L-7
R1 = RC0402FR-071ML: 1 MΩ, 1%, 0402 Resistor; Manufacturer: Yageo; House Part Number: R-1M-0402-1%-001; Additional Feature: LASER TRIMMABLE; Rated Power Dissipation (P): 62.5mW; Rated Temperature: 70°C; Temperature Coefficient: 100ppm/°C; Working Voltage: 50V; Package Height: 0.35mm; Package Length: 1mm; Package Width: 0.5mm; Supplier 1: Digi-Key; Manufacturer Part Number: RC0402FR-071ML; RoHS: Yes; Category: Chip SMD Resistors; Stock 1: 7104113; Pricing 1: 1=0.10000, 10=0.01500, 100=0.00600, 1000=0.00267, 2500=0.00232, 5000=0.00192 (USD); Mount: Surface Mount; Number of Pins: 2; Package Shape: Rectangular; Terminal Finish: Nickel; Min Operating Temperature: -55°C; Max Operating Temperature: 155°C; Tolerance: 1%; JESD-609 Code: e3; Resistor Type: FIXED RESISTOR; Construction: Chip; Package Style: SMTMeter; Packaging: Tape and Reel; Technology: METAL GLAZE/THICK FILM; Termination: Wraparound; Reach SVHC Compliant: Yes; RoHS Compliant: Yes; ComponentLink1URL: https://datasheet.ciiva.com:443/pdfs/VipMasterIC/IC/YAGO/YAGO-S-A0008145938/YAGO-S-A0008145938-1.pdf?src-supplier=IHS+Markit; ComponentLink1Description: https://datasheet.ciiva.com:443/pdfs/VipMasterIC/IC/YAGO/YAGO-S-A0008145938/YAGO-S-A0008145938-1.pdf?src-supplier=IHS+Markit; ComponentLink2URL: http://www.farnell.com/datasheets/1836115.pdf?src-supplier=Farnell; ComponentLink2Description: http://www.farnell.com/datasheets/1836115.pdf?src-supplier=Farnell; ComponentLink3URL: http://www.farnell.com/datasheets/2167052.pdf?src-supplier=Farnell; ComponentLink3Description: http://www.farnell.com/datasheets/2167052.pdf?src-supplier=Farnell; ComponentLink4URL: http://www.farnell.com/datasheets/2167052.pdf?src-supplier=Element14; ComponentLink4Description: http://www.farnell.com/datasheets/2167052.pdf?src-supplier=Element14; Supplier Part Number 1: 311-1.00MLRCT-ND
R2 R7 R13 R14 R16 = RMCF0402FT100R: 100 Ω, 0402 Chip resistor; Manufacturer: Stackpole Electronics; house_part_number: R-100-0402-1%-001; Power Rating: 62.5mW; Tolerance: 1%; Max Power Dissipation: 63mW; Temperature Coefficient: 100ppm/°C; Supplier 1: Digi-Key; Supplier Part Number 1: RMCF0402FT100RCT-ND; RoHS: Yes; Category: Chip SMD Resistors; Stock 1: 188482; Pricing 1: 1=0.10000, 10=0.01300, 100=0.00530, 1000=0.00238, 2500=0.00207, 5000=0.00171 (USD); Mount: Surface Mount; Case/Package: 0402; Case Code (Metric): 1005; Contact Plating: Tin,Matte; Min Operating Temperature: -55°C; Max Operating Temperature: 155°C; Packaging: Tape and Reel; Resistor Type: Thick Film; Number of Terminations: 2; Features: Automotive AEC-Q200; Series: RMCF; Construction: Rectangular; Length: 1mm; Width: 0.02inch; Height: 0.016inch; Depth: 0.5mm; Military Standard: Not; Lead Free: Lead Free; RoHS Compliant: Yes; ComponentLink1URL: http://components.arrow.com/part/dataview/50497758S7215546N1174?src-supplier=Arrow+Electronics; ComponentLink1Description: http://components.arrow.com/part/dataview/50497758S7215546N1174?src-supplier=Arrow+Electronics; ComponentLink2URL: https://www.seielect.com/catalog/sei-rmcf_rmcp.pdf?src-supplier=Digi-Key; ComponentLink2Description: https://www.seielect.com/catalog/sei-rmcf_rmcp.pdf?src-supplier=Digi-Key; ComponentLink3URL: https://www.seielect.com/Catalog/SEI-RMCF_RMCP.pdf?src-supplier=Avnet; ComponentLink3Description: https://www.seielect.com/Catalog/SEI-RMCF_RMCP.pdf?src-supplier=Avnet; ComponentLink4URL: https://www.verical.com/server-webapp/html/getDatasheet?partID=368652&src-supplier=Verical; ComponentLink4Description: https://www.verical.com/server-webapp/html/getDatasheet?partID=368652&src-supplier=Verical; ComponentLink5URL: https://www.seielect.com/Catalog/SEI-RMCF_RMCP.pdf?src-supplier=Avnet+Asia; ComponentLink5Description: https://www.seielect.com/Catalog/SEI-RMCF_RMCP.pdf?src-supplier=Avnet+Asia; Manufacturer Part Number: RMCF0402FT100R
R3 R11 R12 = RMCF0402FT10K0: 10 kΩ, 0402 Chip resistor; Manufacturer: Stackpole Electronics; house_part_number: R-10k-0402-1%-001; Tolerance: 1%; Power Rating: 62.5mW; Temperature Coefficient: 100ppm/°C; Max Power Dissipation: 63mW; Supplier 1: Digi-Key; Manufacturer Part Number: RMCF0402FT10K0; RoHS: Yes; Category: Chip SMD Resistors; Stock 1: 7219214; Pricing 1: 1=0.10000, 10=0.01300, 100=0.00530, 1000=0.00239, 2500=0.00207, 5000=0.00171 (USD); Mount: Surface Mount; Case/Package: 0402; Case Code (Metric): 1005; Contact Plating: Tin,Matte; Size Code: 0402; Min Operating Temperature: -55°C; Max Operating Temperature: 155°C; Packaging: Tape and Reel; Resistor Type: Thick Film; Number of Terminations: 2; Features: Automotive AEC-Q200; Series: RMCF; Construction: Rectangular; Length: 1mm; Width: 0.02inch; Height: 0.016inch; Depth: 0.5mm; Radiation Hardening: No; Military Standard: Not; Lead Free: Lead Free; RoHS Compliant: Yes; ComponentLink1URL: https://datasheet.ciiva.com/24341/sei-rmcp-24341800.pdf?src-supplier=Onlinecomponents.com; ComponentLink1Description: https://datasheet.ciiva.com/24341/sei-rmcp-24341800.pdf?src-supplier=Onlinecomponents.com; Supplier Part Number 1: RMCF0402FT10K0CT-ND
R4 = RMCF0402FT49R9: 49.9 Ω, 0402 Chip resistor; Manufacturer: Stackpole Electronics; house_part_number: R-49.9-0402-1%-001; Tolerance: 1%; Power Rating: 63mW; Temperature Coefficient: 100ppm/°C; Supplier 1: Digi-Key; Supplier Part Number 1: RMCF0402FT49R9CT-ND; RoHS: Yes; Category: Chip SMD Resistors; Stock 1: 723706; Pricing 1: 1=0.10000, 10=0.01300, 100=0.00530, 1000=0.00238, 2500=0.00207, 5000=0.00171 (USD); Mount: Surface Mount; Case Code (Metric): 1005; Contact Plating: Tin,Matte; Size Code: 0402; Min Operating Temperature: -55°C; Max Operating Temperature: 155°C; Packaging: Tape and Reel; Resistor Type: Thick Film; Number of Terminations: 2; Max Power Dissipation: 63mW; Features: Automotive AEC-Q200; Series: RMCF; Construction: Rectangular; Length: 1mm; Width: 0.02inch; Height: 0.016inch; Depth: 0.5mm; Radiation Hardening: No; Military Standard: Not; Lead Free: Lead Free; RoHS Compliant: Yes; ComponentLink1URL: http://components.arrow.com/part/dataview/44987983S6966749N1174?src-supplier=Arrow+Electronics; ComponentLink1Description: http://components.arrow.com/part/dataview/44987983S6966749N1174?src-supplier=Arrow+Electronics; ComponentLink2URL: https://www.verical.com/server-webapp/html/getDatasheet?partID=362596&src-supplier=Verical; ComponentLink2Description: https://www.verical.com/server-webapp/html/getDatasheet?partID=362596&src-supplier=Verical; ComponentLink3URL: http://www.seielect.com/Catalog/SEI-RMCF_RMCP.pdf?src-supplier=Future+Electronics; ComponentLink3Description: http://www.seielect.com/Catalog/SEI-RMCF_RMCP.pdf?src-supplier=Future+Electronics; ComponentLink4URL: https://www.seielect.com/catalog/SEI-RMCF_RMCP.pdf?src-supplier=Avnet; ComponentLink4Description: https://www.seielect.com/catalog/SEI-RMCF_RMCP.pdf?src-supplier=Avnet; ComponentLink5URL: https://www.seielect.com/Catalog/SEI-RMCF_RMCP.pdf?src-supplier=Digi-Key; ComponentLink5Description: https://www.seielect.com/Catalog/SEI-RMCF_RMCP.pdf?src-supplier=Digi-Key; Manufacturer Part Number: RMCF0402FT49R9; Case/Package: 0402
R5 R6 R8 R9 = RMCF0402FT100K: 100 kΩ, 0402 Chip resistor; Manufacturer: Stackpole Electronics; Tolerance: 1%; Power: 63mW; Rated Temperature: 70°C; Temperature Coefficient: 100ppm/°C; Working Voltage: 50V; Package Height: 0.3mm; Package Length: 1mm; Package Width: 0.5mm; Reference Standard: AEC-Q200; Supplier 1: Digi-Key; Manufacturer Part Number: RMCF0402FT100K; RoHS: Yes; Category: Chip SMD Resistors; Stock 1: 3573736; Pricing 1: 1=0.1, 10=0.02, 50=0.011, 100=0.0089, 500=0.00566, 1000=0.00475, 5000=0.00328 (USD); Mounting Technology: Surface Mount; Pins: 2; Package Shape: Rectangular; Terminal Finish: Nickel; Min Operating Temperature: -55°C; Max Operating Temperature: 155°C; JESD-609 Code: e3; Resistor Type: FIXED RESISTOR; Construction: Rectangular; Package Style: SMTMeter; Packaging: Tape and Reel; Technology: METAL GLAZE/THICK FILM; Termination: Wraparound; Reach SVHC Compliant: Yes; RoHS Compliant: Yes; ComponentLink1URL: https://datasheet.ciiva.com:443/pdfs/VipMasterIC/IC/SEIE/SEIE-S-A0009541969/SEIE-S-A0009541969-1.pdf?src-supplier=IHS+Markit; ComponentLink1Description: https://datasheet.ciiva.com:443/pdfs/VipMasterIC/IC/SEIE/SEIE-S-A0009541969/SEIE-S-A0009541969-1.pdf?src-supplier=IHS+Markit; ComponentLink2URL: https://datasheet.ciiva.com/15193/getdatasheetpartid-482656-15193415.pdf?src-supplier=Verical; ComponentLink2Description: https://datasheet.ciiva.com/15193/getdatasheetpartid-482656-15193415.pdf?src-supplier=Verical; Supplier Part Number 1: RMCF0402FT100KCT-ND
R10 = RMCF0402FT22K1: 22.1 kΩ, 1%, 0402 Chip resistor; Manufacturer: Stackpole Electronics; Power: 63mW; Rated Temperature: 70°C; Temperature Coefficient: 100ppm/°C; Working Voltage: 50V; Package Height: 0.3mm; Package Length: 1mm; Package Width: 0.5mm; Reference Standard: AEC-Q200; Supplier 1: Digi-Key; Manufacturer Part Number: RMCF0402FT22K1; RoHS: Yes; Category: Chip SMD Resistors; Stock 1: 536826; Pricing 1: 1=0.1, 10=0.02, 50=0.011, 100=0.0089, 500=0.00566, 1000=0.00475, 5000=0.00328 (USD); Mounting Technology: Surface Mount; Pins: 2; Package Shape: Rectangular; Terminal Finish: Nickel; Min Operating Temperature: -55°C; Max Operating Temperature: 155°C; Tolerance: 1%; JESD-609 Code: e3; Resistor Type: FIXED RESISTOR; Construction: Rectangular; Package Style: SMTMeter; Packaging: Tape and Reel; Technology: METAL GLAZE/THICK FILM; Termination: Wraparound; Reach SVHC Compliant: Yes; RoHS Compliant: Yes; ComponentLink1URL: https://datasheet.ciiva.com:443/pdfs/VipMasterIC/IC/SEIE/SEIE-S-A0009541969/SEIE-S-A0009541969-1.pdf?src-supplier=IHS+Markit; ComponentLink1Description: https://datasheet.ciiva.com:443/pdfs/VipMasterIC/IC/SEIE/SEIE-S-A0009541969/SEIE-S-A0009541969-1.pdf?src-supplier=IHS+Markit; ComponentLink2URL: http://components.arrow.com/part/dataview/50500388S32218N1174?src-supplier=Arrow+Electronics; ComponentLink2Description: http://components.arrow.com/part/dataview/50500388S32218N1174?src-supplier=Arrow+Electronics; ComponentLink3URL: https://www.seielect.com/catalog/SEI-RMCF_RMCP.pdf?src-supplier=Avnet; ComponentLink3Description: https://www.seielect.com/catalog/SEI-RMCF_RMCP.pdf?src-supplier=Avnet; ComponentLink4URL: https://www.seielect.com/Catalog/SEI-RMCF_RMCP.pdf?src-supplier=Digi-Key; ComponentLink4Description: https://www.seielect.com/Catalog/SEI-RMCF_RMCP.pdf?src-supplier=Digi-Key; ComponentLink5URL: https://www.seielect.com/catalog/SEI-Packaging.pdf?src-supplier=Digi-Key; ComponentLink5Description: https://www.seielect.com/catalog/SEI-Packaging.pdf?src-supplier=Digi-Key; Supplier Part Number 1: RMCF0402FT22K1DKR-ND
R15 = CR0402-FX-1001GLF: 1 kΩ, 0402 Chip resistor; Manufacturer: Bourns; Tolerance: 1%; Rated Power Dissipation (P): 62.5mW; Rated Temperature: 70°C; Temperature Coefficient: 100ppm/°C; Working Voltage: 50V; Package Height: 0.35mm; Package Length: 1mm; Package Width: 0.5mm; Supplier 1: Digi-Key; Manufacturer Part Number: CR0402-FX-1001GLF; RoHS: Yes; Category: Chip SMD Resistors; Stock 1: 398310; Pricing 1: 10000=0.00114 (USD); Mount: Surface Mount; Number of Pins: 2; Package Shape: Rectangular; Terminal Finish: Nickel; Min Operating Temperature: -55°C; Max Operating Temperature: 125°C; JESD-609 Code: e3; Resistor Type: FIXED RESISTOR; Construction: Chip; Package Style: SMTMeter; Packaging: Tape and Reel; Technology: RUTHENIUM OXIDE; Termination: Wraparound; REACH SVHC: Yes; RoHS Compliant: Yes; ComponentLink1URL: https://datasheet.ciiva.com:443/pdfs/VipMasterIC/IC/BOUR/BOUR-S-A0008953887/BOUR-S-A0008953887-1.pdf?src-supplier=IHS+Markit; ComponentLink1Description: https://datasheet.ciiva.com:443/pdfs/VipMasterIC/IC/BOUR/BOUR-S-A0008953887/BOUR-S-A0008953887-1.pdf?src-supplier=IHS+Markit; ComponentLink2URL: https://datasheet.ciiva.com/5734/1845296-5734926.pdf?src-supplier=Farnell; ComponentLink2Description: https://datasheet.ciiva.com/5734/1845296-5734926.pdf?src-supplier=Farnell; ComponentLink3URL: https://datasheet.ciiva.com/11821/0900766b80fcdb41-11821108.pdf?src-supplier=RSComponents; ComponentLink3Description: https://datasheet.ciiva.com/11821/0900766b80fcdb41-11821108.pdf?src-supplier=RSComponents; ComponentLink4URL: https://datasheet.ciiva.com/9123/cr0402-9123631.pdf?src-supplier=Avnet; ComponentLink4Description: https://datasheet.ciiva.com/9123/cr0402-9123631.pdf?src-supplier=Avnet; ComponentLink5URL: https://datasheet.ciiva.com/30154/cr0402-30154590.pdf?src-supplier=Onlinecomponents.com; ComponentLink5Description: https://datasheet.ciiva.com/30154/cr0402-30154590.pdf?src-supplier=Onlinecomponents.com; Supplier Part Number 1: CR0402-FX-1001GLFTR-ND
TP1-TP12 = test_point-1: Test point; pickable: no
U1 = TPS54202DDCR: Switching Regulator, Current-mode, 2A, 500kHz Switching Freq-Max, PDSO6; Manufacturer: Texas Instruments; Package Body Material: Plastic; Control Technique: PULSE WIDTH MODULATION; Max Supply Voltage: 28V; Min Input Voltage: 4.5V; Nominal Supply Voltage: 12V; Channels: 1; Max Output current: 3.9A; Frequency: 590kHz; Supplier 1: Digi-Key; RoHS: Yes; Category: Voltage Regulators - Switching; Stock 1: 4766; Pricing 1: 1=1.29, 10=1.154, 25=1.0956, 100=0.9001, 250=0.8414, 500=0.74356, 1000=0.58702 (USD); Pins: 6; Package Shape: Rectangular; Terminal Finish: Tin; Min Operating Temperature: -40°C; Max Operating Temperature: 125°C; JESD-609 Code: e3; Throw Configuration: SWITCHING REGULATOR; Control Mode: CURRENT-MODE; JESD-30 Code: R-PDSO-G6; Moisture Sensitivity Level: 1; Package Style: SMALL OUTLINE, THIN PROFILE, SHRINK PITCHMeter; Surface Mount: Yes; Switcher Configuration: BUCK; Terminal Form: Gull Wing; Terminal Position: DUAL; Length: 2.9mm; Width: 1.6mm; Height - Seated (Max): 1.1mm; Terminal Pitch: 0.95mm; Temperature Grade: AUTOMOTIVE; Reach SVHC Compliant: Yes; RoHS Compliant: Yes; ComponentLink1URL: https://www.ti.com:443/lit/ds/symlink/tps54202.pdf?src-supplier=IHS+Markit; ComponentLink1Description: https://www.ti.com:443/lit/ds/symlink/tps54202.pdf?src-supplier=IHS+Markit; ComponentLink2URL: http://www.ti.com/general/docs/suppproductinfo.tsp?distId=10&gotoUrl=http%3A%2F%2Fwww.ti.com%2Flit%2Fgpn%2Ftps54202&src-supplier=Digi-Key; ComponentLink2Description: http://www.ti.com/general/docs/suppproductinfo.tsp?distId=10&gotoUrl=http%3A%2F%2Fwww.ti.com%2Flit%2Fgpn%2Ftps54202&src-supplier=Digi-Key; ComponentLink3URL: http://www.ti.com/lit/ds/symlink/tps54202.pdf?src-supplier=Digi-Key; ComponentLink3Description: http://www.ti.com/lit/ds/symlink/tps54202.pdf?src-supplier=Digi-Key; ComponentLink4URL: http://www.ti.com/general/docs/suppproductinfo.tsp?distId=10&amp;gotoUrl=http%3A%2F%2Fwww.ti.com%2Flit%2Fgpn%2Ftps54202&src-supplier=Digi-Key; ComponentLink4Description: http://www.ti.com/general/docs/suppproductinfo.tsp?distId=10&amp;gotoUrl=http%3A%2F%2Fwww.ti.com%2Flit%2Fgpn%2Ftps54202&src-supplier=Digi-Key; Supplier Part Number 1: 296-TPS54202DDCRDKR-ND; Case/Package: SOT-23-6; Manufacturer Part Number: TPS54202DDCR
U2 = W25Q128JVSIM TR: 128Mb SPI flash memory; Manufacturer: Winbond; Memory Type: Non-Volatile,FLASH; Frequency: 133MHz; Supplier 1: Digi-Key; Stock 1: 0; Pricing 1: 1=1.69, 10=1.545, 25=1.5028, 50=1.495, 100=1.3364, 250=1.3325, 500=1.3124, 1000=1.2567 (USD); Mount: Surface Mount; Number of Pins: 8; Min Operating Temperature: -40°C; Max Operating Temperature: 85°C; Packaging: Cut Tape; Memory Size: 128Mb; ComponentLink1URL: http://www.winbond.com/resource-files/w25q128jv_dtr%20revc%2003272018%20plus.pdf?src-supplier=Digi-Key; ComponentLink1Description: http://www.winbond.com/resource-files/w25q128jv_dtr%20revc%2003272018%20plus.pdf?src-supplier=Digi-Key; Supplier Part Number 1: W25Q128JVSIMCT-ND; house_part_number: W25Q128JVSIM; Manufacturer Part Number: W25Q128JVSIM TR
U3 = RP2040: Raspberry Pi microcontroller, QFN-56; Manufacturer: Raspberry Pi; Supplier: Newark; Supplier Part Number: 49AJ8739; RoHS: No; Category: Uncategorized; Stock: 720; Pricing: 1=1 (USD); Manufacturer Part Number: RP2040; Package: QFN-56
Y1 = X50328MSB2GI: 8 MHz crystal, 20 pF, ±50ppm, SMD-5032; Manufacturer: YXC; Supplier 1: LCSC; RoHS: No; Stock 1: 138605; Pricing 1: 5=0.1818, 50=0.1439, 150=0.1254, 1000=0.1089, 2000=0.1043, 5000=0.1016 (USD); Supplier Part Number 1: C115962; Package: SMD-5032; Manufacturer Part Number: X50328MSB2GI